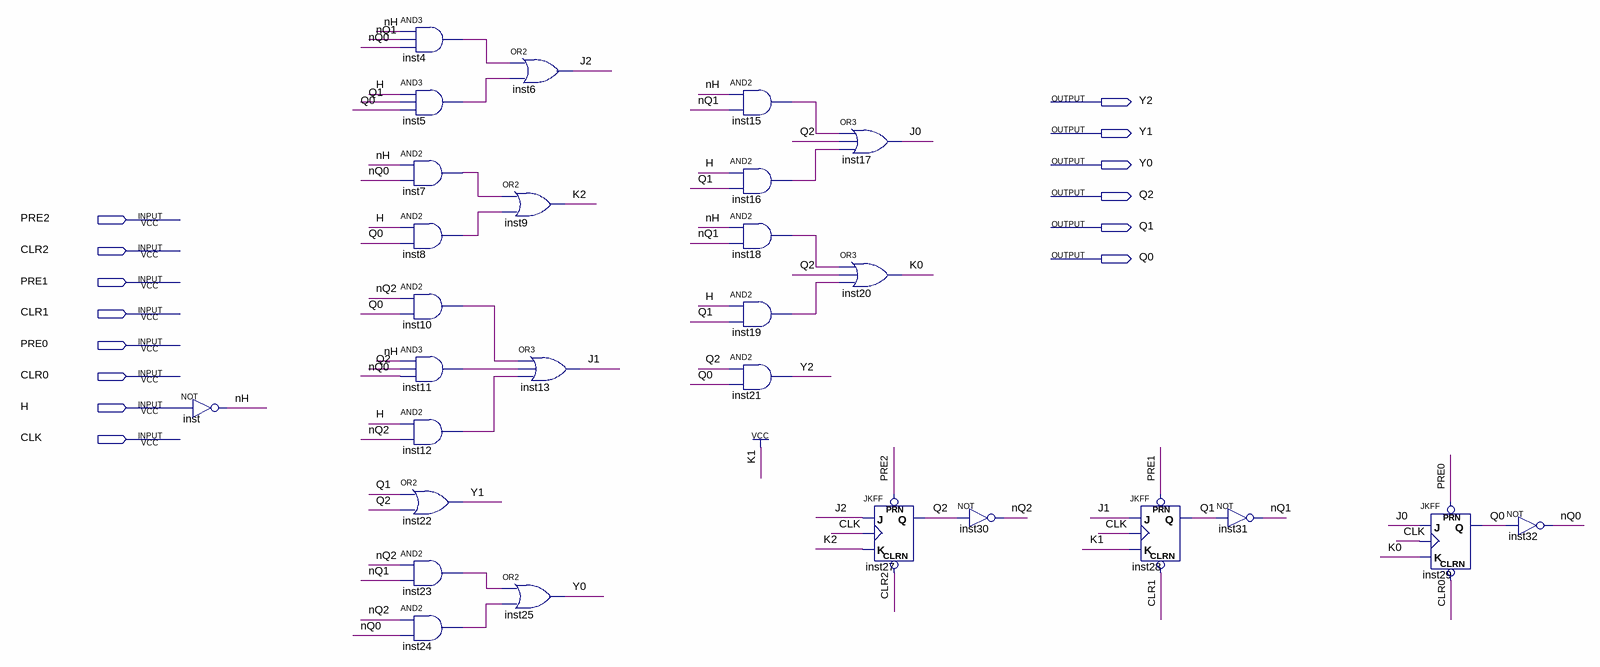
[diagram p0: schematic sheet]
// Quartus schematic MaquinadeEstado.bdf as structural Verilog: 28 symbols, 14 pins
module MaquinadeEstado (
  input  PRE2,
  input  CLR2,
  input  PRE1,
  input  CLR1,
  input  PRE0,
  input  CLR0,
  input  H,
  input  CLK,
  output Y2,
  output Y1,
  output Y0,
  output Q2,
  output Q1,
  output Q0
);

  wire inst4_out, inst5_out, inst7_out, inst8_out, inst10_out, inst11_out, inst12_out, inst15_out,
       inst16_out, inst18_out, inst19_out, inst23_out, inst24_out, J0, J1, J2, K0, K2, nH, nQ0, nQ1, nQ2;

  not inst (nH, H);
  and inst4 (inst4_out, nH, nQ1, nQ0);
  and inst5 (inst5_out, H, Q1, Q0);
  and inst7 (inst7_out, nH, nQ0);
  and inst8 (inst8_out, H, Q0);
  and inst10 (inst10_out, nQ2, Q0);
  and inst11 (inst11_out, nH, Q2, nQ0);
  and inst12 (inst12_out, H, nQ2);
  or inst22 (Y1, Q1, Q2);
  and inst23 (inst23_out, nQ2, nQ1);
  and inst24 (inst24_out, nQ2, nQ0);
  or inst6 (J2, inst4_out, inst5_out);
  or inst9 (K2, inst7_out, inst8_out);
  or inst13 (J1, inst10_out, inst11_out, inst12_out);
  or inst25 (Y0, inst23_out, inst24_out);
  and inst15 (inst15_out, nH, nQ1);
  and inst16 (inst16_out, H, Q1);
  and inst18 (inst18_out, nH, nQ1);
  and inst19 (inst19_out, H, Q1);
  and inst21 (Y2, Q2, Q0);
  or inst17 (J0, inst15_out, Q2, inst16_out);
  or inst20 (K0, inst18_out, Q2, inst19_out);
  JKFF inst27 (.PRN(PRE2), .CLRN(CLR2), .K(K2), .J(J2), .CLK(CLK), .Q(Q2));
  not inst30 (nQ2, Q2);
  JKFF inst28 (.PRN(PRE1), .CLRN(CLR1), .K(1'b1), .J(J1), .CLK(CLK), .Q(Q1));
  not inst31 (nQ1, Q1);
  JKFF inst29 (.PRN(PRE0), .CLRN(CLR0), .K(K0), .J(J0), .CLK(CLK), .Q(Q0));
  not inst32 (nQ0, Q0);
endmodule
